# Altium schematic sheet PCB.SchDoc
size A4
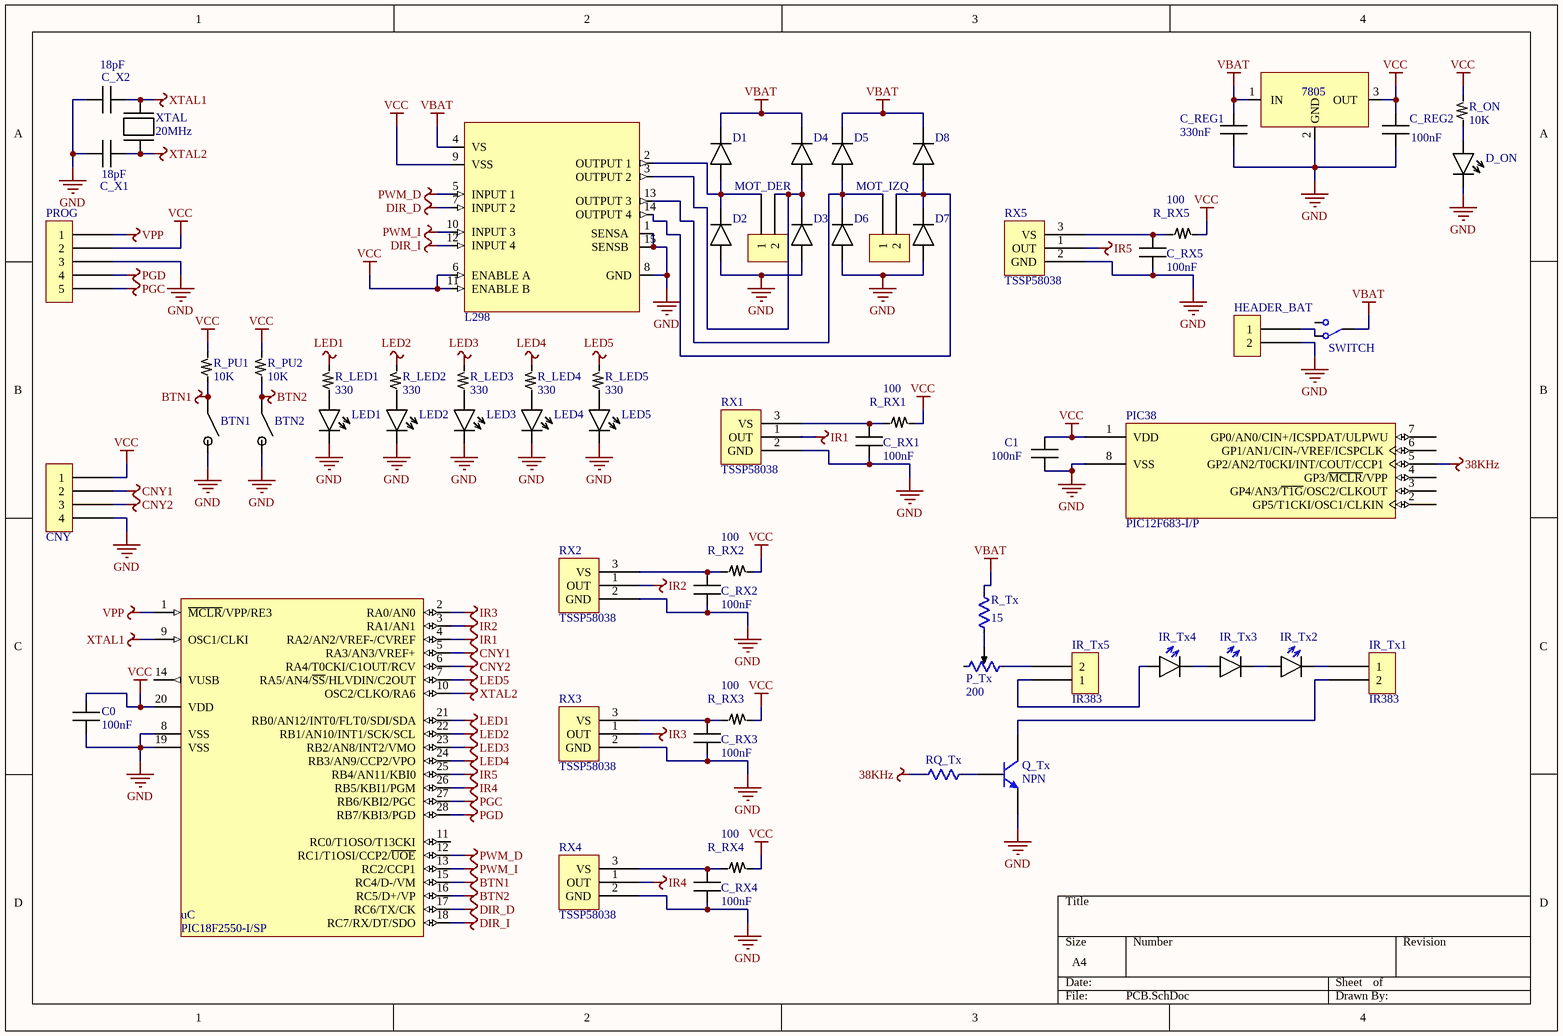
[diagram p0: PCB.SchDoc]

## Parts
7805  LM7805  [TO-252]  (value not drawn)
BTN1  SWITCH  [TACT_SWITCH-SMALL-4PIN]  (value not drawn)
BTN2  SWITCH  [TACT_SWITCH-SMALL-4PIN]  (value not drawn)
C0  value 100nF  [CAP-1206]  (hidden comment: CAP-CER)
C1  value 100nF  [CAP-1206]  (hidden comment: CAP-CER)
C_REG1  value 330nF  [CAP-1206]  (hidden comment: CAP-CER)
C_REG2  value 100nF  [CAP-1206]  (hidden comment: CAP-CER)
C_RX1  value 100nF  [CAP-1206]  (hidden comment: CAP-CER)
C_RX2  value 100nF  [CAP-1206]  (hidden comment: CAP-CER)
C_RX3  value 100nF  [CAP-1206]  (hidden comment: CAP-CER)
C_RX4  value 100nF  [CAP-1206]  (hidden comment: CAP-CER)
C_RX5  value 100nF  [CAP-1206]  (hidden comment: CAP-CER)
C_X1  value 18pF  [CAP-1206]  (hidden comment: CAP-CER)
C_X2  value 18pF  [CAP-1206]  (hidden comment: CAP-CER)
CNY  Header 1x4  [Header 1x4]  (value not drawn)
D1  (no value)  [DO-214AC]
D2  (no value)  [DO-214AC]
D3  (no value)  [DO-214AC]
D4  (no value)  [DO-214AC]
D5  (no value)  [DO-214AC]
D6  (no value)  [DO-214AC]
D7  (no value)  [DO-214AC]
D8  (no value)  [DO-214AC]
D_ON  LED  [LED-3MM-RED]  (value not drawn)
HEADER_BAT  (no value)  [HEADER 1x2]
IR_Tx1  IR383  [HEADER 1x2]
IR_Tx2  LED  [LED-3MM-YELLOW]  (value not drawn)
IR_Tx3  LED  [LED-3MM-YELLOW]  (value not drawn)
IR_Tx4  LED  [LED-3MM-YELLOW]  (value not drawn)
IR_Tx5  IR383  [HEADER 1x2]
L298  L298  [Multiwatt15]  (value not drawn)
LED1  LED  [LED-3MM-RED]  (value not drawn)
LED2  LED  [LED-3MM-RED]  (value not drawn)
LED3  LED  [LED-3MM-RED]  (value not drawn)
LED4  LED  [LED-3MM-RED]  (value not drawn)
LED5  LED  [LED-3MM-RED]  (value not drawn)
MOT_DER  (no value)  [HEADER 1x2]
MOT_IZQ  (no value)  [HEADER 1x2]
P_Tx  value 200  [POT-10TURN]  (hidden comment: POT)
PIC38  PIC12F683-I/P  [PDIP300-P8]
PROG  (no value)  [Header 1x5]
Q_Tx  NPN  [SOT-23]
R_LED1  value 330  [RES-1206]  (hidden comment: RES)
R_LED2  value 330  [RES-1206]  (hidden comment: RES)
R_LED3  value 330  [RES-1206]  (hidden comment: RES)
R_LED4  value 330  [RES-1206]  (hidden comment: RES)
R_LED5  value 330  [RES-1206]  (hidden comment: RES)
R_ON  value 10K  [RES-1206]  (hidden comment: RES)
R_PU1  value 10K  [RES-1206]  (hidden comment: RES)
R_PU2  value 10K  [RES-1206]  (hidden comment: RES)
R_RX1  value 100  [RES-1206]  (hidden comment: RES)
R_RX2  value 100  [RES-1206]  (hidden comment: RES)
R_RX3  value 100  [RES-1206]  (hidden comment: RES)
R_RX4  value 100  [RES-1206]  (hidden comment: RES)
R_RX5  value 100  [RES-1206]  (hidden comment: RES)
R_Tx  value 15  [RES-1206]  (hidden comment: RES)
RQ_Tx  RES  [RES-1206]  (value not drawn)
RX1  TSSP58038  [TSSP58038]
RX2  TSSP58038  [TSSP58038]
RX3  TSSP58038  [TSSP58038]
RX4  TSSP58038  [TSSP58038]
RX5  TSSP58038  [TSSP58038]
SWITCH  SLIDE-SWITCH  [SWITCH]  (value not drawn)
uC  PIC18F2550-I/SP  [SPDIP300-SP28]
XTAL  FREQUENCY: 20MHz  [HC-49/S]  (hidden comment: CRYSTAL-OSC)

## Nets
38KHz: PIC38.5(GP2/AN2/T0CKI/INT/COUT/CCP1) RQ_Tx.1
BTN1: BTN1.1 R_PU1.2 uC.15(RC4/D-/VM)
BTN2: BTN2.1 R_PU2.2 uC.16(RC5/D+/VP)
CNY1: CNY.2 uC.5(RA3/AN3/VREF+)
CNY2: CNY.3 uC.6(RA4/T0CKI/C1OUT/RCV)
DIR_D: L298.7(INPUT_2) uC.17(RC6/TX/CK)
DIR_I: L298.12(INPUT_4) uC.18(RC7/RX/DT/SDO)
GND: 7805.2(GND) BTN1.2 BTN2.2 C0.1 C1.1 C_REG1.1 C_REG2.1 C_RX1.2 C_RX2.2 C_RX3.2 C_RX4.2 C_RX5.2 C_X1.1 C_X2.1 CNY.4 D2.A D3.A D6.A D7.A D_ON.K HEADER_BAT.2 L298.1(SENSA) L298.8(GND) L298.15(SENSB) LED1.K LED2.K LED3.K LED4.K LED5.K PIC38.8(VSS) PROG.3 Q_Tx.E RX1.2(GND) RX2.2(GND) RX3.2(GND) RX4.2(GND) RX5.2(GND) uC.8(VSS) uC.19(VSS)
IR1: RX1.1(OUT) uC.4(RA2/AN2/VREF-/CVREF)
IR2: RX2.1(OUT) uC.3(RA1/AN1)
IR3: RX3.1(OUT) uC.2(RA0/AN0)
IR4: RX4.1(OUT) uC.26(RB5/KBI1/PGM)
IR5: RX5.1(OUT) uC.25(RB4/AN11/KBI0)
LED1: R_LED1.1 uC.21(RB0/AN12/INT0/FLT0/SDI/SDA)
LED2: R_LED2.1 uC.22(RB1/AN10/INT1/SCK/SCL)
LED3: R_LED3.1 uC.23(RB2/AN8/INT2/VMO)
LED4: R_LED4.1 uC.24(RB3/AN9/CCP2/VPO)
LED5: R_LED5.1 uC.7(RA5/AN4/~{SS}/HLVDIN/C2OUT)
PGC: PROG.5 uC.27(RB6/KBI2/PGC)
PGD: PROG.4 uC.28(RB7/KBI3/PGD)
PWM_D: L298.5(INPUT_1) uC.12(RC1/T1OSI/CCP2/~{UOE})
PWM_I: L298.10(INPUT_3) uC.13(RC2/CCP1)
VBAT: 7805.1(IN) C_REG1.2 D1.K D4.K D5.K D8.K L298.4(VS) R_Tx.2 SWITCH.2
VCC: 7805.3(OUT) C0.2 C1.2 C_REG2.2 CNY.1 L298.6(ENABLE_A) L298.9(VSS) L298.11(ENABLE_B) PIC38.1(VDD) PROG.2 R_ON.1 R_PU1.1 R_PU2.1 R_RX1.1 R_RX2.1 R_RX3.1 R_RX4.1 R_RX5.1 uC.20(VDD)
VPP: PROG.1 uC.1(~{MCLR}/VPP/RE3)
XTAL1: C_X2.2 uC.9(OSC1/CLKI) XTAL.2
XTAL2: C_X1.2 uC.10(OSC2/CLKO/RA6) XTAL.1
NetC_RX1_1: C_RX1.1 R_RX1.2 RX1.3(VS)
NetC_RX2_1: C_RX2.1 R_RX2.2 RX2.3(VS)
NetC_RX3_1: C_RX3.1 R_RX3.2 RX3.3(VS)
NetC_RX4_1: C_RX4.1 R_RX4.2 RX4.3(VS)
NetC_RX5_1: C_RX5.1 R_RX5.2 RX5.3(VS)
NetD1_A: D1.A D2.K L298.2(OUTPUT_1) MOT_DER.1
NetD3_K: D3.K D4.A L298.3(OUTPUT_2) MOT_DER.2
NetD5_A: D5.A D6.K L298.13(OUTPUT_3) MOT_IZQ.1
NetD7_K: D7.K D8.A L298.14(OUTPUT_4) MOT_IZQ.2
NetD_ON_A: D_ON.A R_ON.2
NetHEADER_BAT_1: HEADER_BAT.1 SWITCH.1
NetIR_Tx1_1: IR_Tx1.1 IR_Tx2.K
NetIR_Tx1_2: IR_Tx1.2 Q_Tx.C
NetIR_Tx2_A: IR_Tx2.A IR_Tx3.K
NetIR_Tx3_A: IR_Tx3.A IR_Tx4.K
NetIR_Tx4_A: IR_Tx4.A IR_Tx5.1
NetIR_Tx5_2: IR_Tx5.2 P_Tx.3
NetLED1_A: LED1.A R_LED1.2
NetLED2_A: LED2.A R_LED2.2
NetLED3_A: LED3.A R_LED3.2
NetLED4_A: LED4.A R_LED4.2
NetLED5_A: LED5.A R_LED5.2
NetP_Tx_2: P_Tx.2 R_Tx.1
NetQ_Tx_B: Q_Tx.B RQ_Tx.2

Not connected (* = marked no-connect by the designer): P_Tx 1; PIC38 2(GP5/T1CKI/OSC1/CLKIN) 3(GP4/AN3/~{T1G}/OSC2/CLKOUT) 4(GP3/~{MCLR}/VPP) 6(GP1/AN1/CIN-/VREF/ICSPCLK) 7(GP0/AN0/CIN+/ICSPDAT/ULPWU); SWITCH 3; uC 11(RC0/T1OSO/T13CKI) 14(VUSB)

## Library data of the parts
D1-D8 = DIODE
HEADER_BAT IR_Tx1 IR_Tx5 MOT_DER MOT_IZQ = Header 1x2
PIC38 = PIC12F683-I/P: Flash-Based 8-Bit CMOS Microcontroller with nanoWatt Technology, 2K (x14-Bit words) Program Memory, 384 Bytes Data Memory, 8-Pin PDIP, Industrial Temperature; Published: 29-Jan-2009; LatestRevisionDate: 02-Dec-2009; LatestRevisionNote: Updated to datasheet revision revD, Feb-2007.; DatasheetVersion: revD, Feb-2007; PackageVersion: revBB, Aug-2009; PackageReference: PDIP300-P8; Publisher: Altium Limited; PackageDescription: 8-Lead Plastic Dual In-Line (P) - 300 mil Body [PDIP]; Supplier 1: Digi-Key; Supplier Part Number 1: PIC12F683-I/P-ND; Supplier 2: Farnell; Supplier Part Number 2: 9759034; Supplier 3: Farnell; Supplier Part Number 3: 1523923; Code_JEDEC: MS-001; ComponentLink1Description: Datasheet; ComponentLink1URL: http://ww1.microchip.com/downloads/en/DeviceDoc/41211D_.pdf; ComponentLink2Description: Packaging Specification; ComponentLink2URL: http://www.microchip.com/stellent/groups/techpub_sg/documents/packagingspec/en012702.pdf; ComponentLink3Description: Microchip.com Home; ComponentLink3URL: http://www.microchip.com/
PROG = Header 1x5
uC = PIC18F2550-I/SP: High Performance, Enhanced Flash, USB Microcontroller with nanoWatt Technology, 32K Flash, 28-Pin SPDIP, Industrial Temperature Range; Published: 29-Jan-2009; LatestRevisionDate: 02-Dec-2009; LatestRevisionNote: Updated to datasheet revision E, Aug-2008; DatasheetVersion: revE, Aug-2008; PackageVersion: revBB, Aug-2009; PackageReference: SPDIP300-SP28; Publisher: Altium Limited; PackageDescription: 28-Lead Skinny Plastic Dual In-Line (SP) - 300 mil Body [SPDIP]; Supplier 1: Digi-Key; Supplier Part Number 1: PIC18F2550-I/SP-ND; Supplier 2: Farnell; Supplier Part Number 2: 9321250; Supplier 3: Farnell; Supplier Part Number 3: 1523822; ComponentLink1Description: Datasheet; ComponentLink1URL: http://ww1.microchip.com/downloads/en/DeviceDoc/39632e.pdf; ComponentLink2Description: Packaging Specification; ComponentLink2URL: http://www.microchip.com/stellent/groups/techpub_sg/documents/packagingspec/en012702.pdf; ComponentLink3Description: Microchip.com Home; ComponentLink3URL: http://www.microchip.com/